# EAGLE design VCF-LM324-Stereo (EAGLE 7.2.0)
Voltage-Controlled Low-Pass Filter using LM324 Quad-Opamp (Stereo) http://electro-music.com/forum/topic-45231-0.html&postdays=0&postorder=asc&highlight=
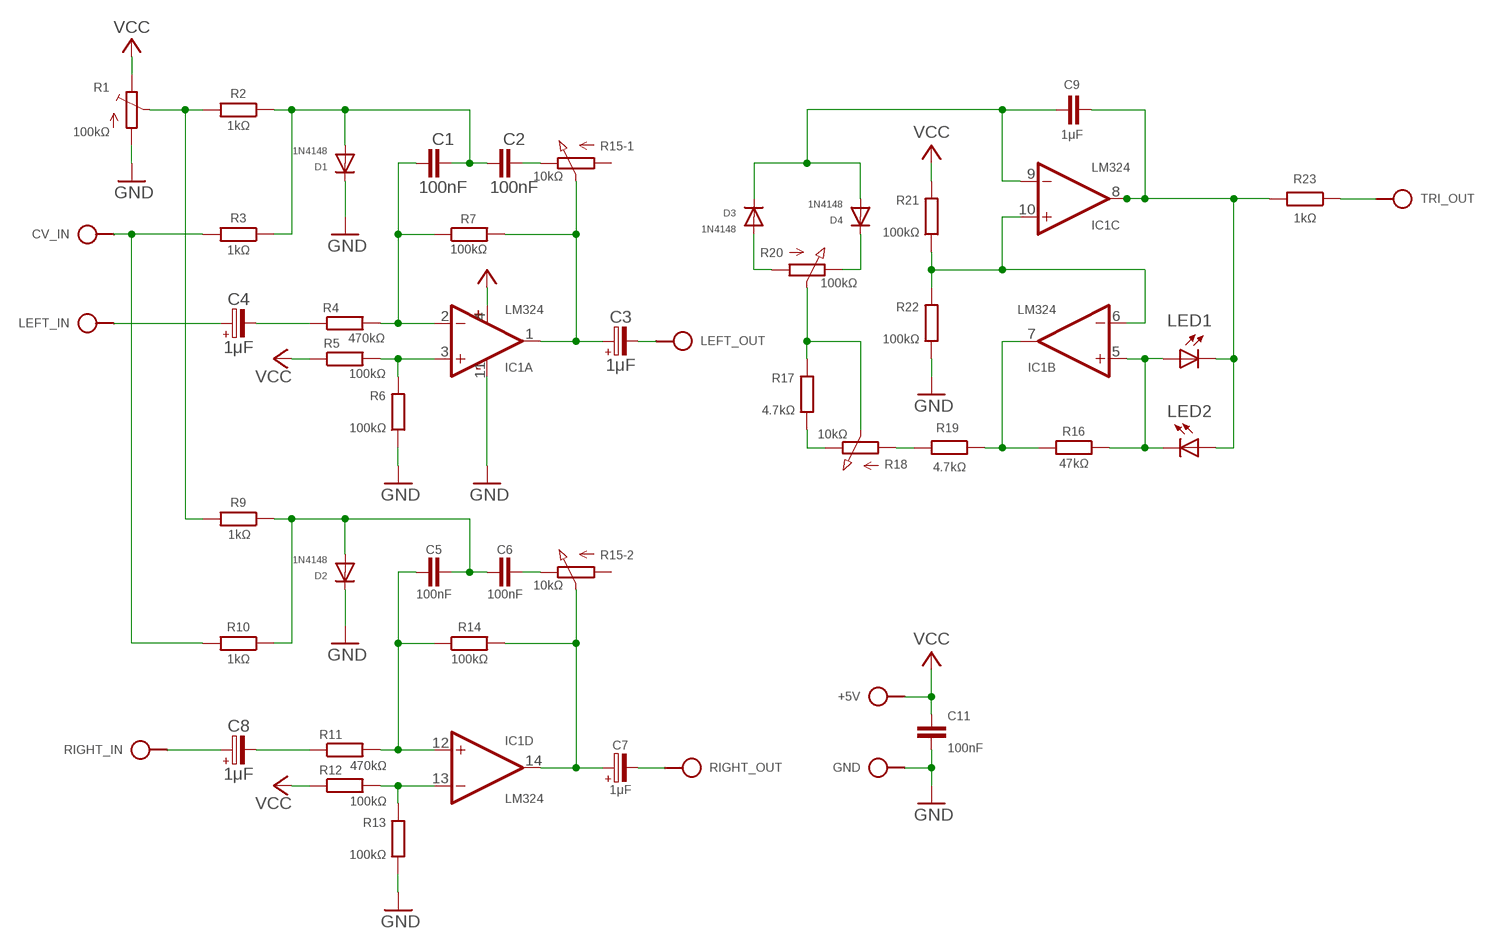
[diagram p0: schematic, sheet 1]

## Parts
+5V  VCC  SPAD  [SPAD]
C1  100nF  C050-024X044  [C050-024X044]
C2  100nF  C050-024X044  [C050-024X044]
C3  1μF  CPOLE2,5-3  [E2,5-3]
C4  1μF  CPOLE2,5-3  [E2,5-3]
C5  100nF  C050-024X044  [C050-024X044]
C6  100nF  C050-024X044  [C050-024X044]
C7  1μF  CPOLE2,5-3  [E2,5-3]
C8  1μF  CPOLE2,5-3  [E2,5-3]
C9  1μF  C050-024X044/V  [C050-024X044/V]
C11  100nF  C050-020X036  [C050-020X036]
CV_IN  CV_IN  SPAD  [SPAD]
D1  1N4148  1N414834-10V  [DO34-10V]
D2  1N4148  1N414834-7V  [DO34-7V]
D3  1N4148  1N414834-7V  [DO34-7V]
D4  1N4148  1N414834-7V  [DO34-7V]
GND  GND  SPAD  [SPAD]
IC1  LM324  LM324N  [DIL14]
LED1  LED3MM  [LED3MM]
LED2  LED3MM  [LED3MM]
LEFT_IN  AUDIO_IN  SPAD  [SPAD]
LEFT_OUT  AUDIO_OUT  SPAD  [SPAD]
R1  100kΩ  TRIM  [B64Y]
R2  1kΩ  R0202/7  [0202/7]
R3  1kΩ  R0202/7  [0202/7]
R4  470kΩ  R0202/7  [0202/7]
R5  100kΩ  R0202/7  [0202/7]
R6  100kΩ  R0202/7  [0202/7]
R7  100kΩ  R0202/7  [0202/7]
R9  1kΩ  R0202/10  [0202/10]
R10  1kΩ  R0202/10  [0202/10]
R11  470kΩ  R0202/7  [0202/7]
R12  100kΩ  R0202/7  [0202/7]
R13  100kΩ  R0202/7  [0202/7]
R14  100kΩ  R0202/7  [0202/7]
R15  10kΩ  POT-STEREO  [POT-STEREO-2X3]
R16  47kΩ  R0202/7-V  [0202/7-V]
R17  4.7kΩ  R0202/7  [0202/7]
R18  10kΩ  POT  [POT]
R19  4.7kΩ  R0202/7-V  [0202/7-V]
R20  100kΩ  POT  [POT]
R21  100kΩ  R0202/7-V  [0202/7-V]
R22  100kΩ  R0202/7-V  [0202/7-V]
R23  1kΩ  R0202/7-V  [0202/7-V]
RIGHT_IN  AUDIO_IN  SPAD  [SPAD]
RIGHT_OUT  AUDIO_OUT  SPAD  [SPAD]
TRI_OUT  TRIANGLE  SPAD  [SPAD]

## Nets
GND: C11.2 D1.C D2.C GND.1 IC1.11(P:V-) R1.A R6.1 R13.1 R22.1
N$1: C4.+ LEFT_IN.1
N$2: C1.1 IC1.2(A:-IN) R4.2 R7.1
N$3: C2.2 R15.1-E(-1:E)
N$4: C3.+ IC1.1(A:OUT) R7.2 R15.1-S(-1:S)
N$5: R1.S R2.2 R9.2
N$6: C3.- LEFT_OUT.1
N$7: IC1.3(A:+IN) R5.2 R6.2
N$8: CV_IN.1 R3.2 R10.2
N$9: C1.2 C2.1 D1.A R2.1 R3.1
N$10: C4.- R4.1
N$11: C6.2 R15.2-E(-2:E)
N$12: C7.+ IC1.14(D:OUT) R14.2 R15.2-S(-2:S)
N$13: IC1.13(D:-IN) R12.2 R13.2
N$14: IC1.7(B:OUT) R16.2 R19.1
N$15: IC1.5(B:+IN) LED1.A LED2.K(C) R16.1
N$16: C5.2 C6.1 D2.A R9.1 R10.1
N$17: C5.1 IC1.12(D:+IN) R11.2 R14.1
N$18: C7.- RIGHT_OUT.1
N$19: C8.+ RIGHT_IN.1
N$20: C8.- R11.1
N$26: C9.1 D3.C D4.A IC1.9(C:-IN)
N$28: C9.2 IC1.8(C:OUT) LED1.K(C) LED2.A R23.2
OA_C_IN+: IC1.6(B:-IN) IC1.10(C:+IN) R21.1 R22.2
TRI_OUT: R23.1 TRI_OUT.1
TRIM_1_A: D3.A R20.1(A)
TRIM_1_B: D4.C R20.3(E)
TRIM_2_A: R17.1 R18.3(E)
TRIM_2_B: R18.1(A) R19.2
TRIM_P: R17.2 R18.2(S) R20.2(S)
VCC: +5V.1 C11.1 IC1.4(P:V+) R1.E R5.1 R12.1 R21.2
Unconnected: R15.1-A(-1:A) R15.2-A(-2:A)

## Library data of the parts
+5V CV_IN GND LEFT_IN LEFT_OUT RIGHT_IN RIGHT_OUT TRI_OUT = pad:SPAD
C1 C2 C5 C6 C9 C11 = c:C: CAPACITOR, European symbol
C3 C4 C7 C8 = c:CPOL: POLARIZED CAPACITOR, European symbol
D1-D4 = d:1N4148
IC1 = ic:LM324: OP AMP
LED1 LED2 = led:LED: LED OSRAM: - CHIPLED LG R971, LG N971, LY N971, LG Q971, LY Q971, LO R971, LY R971 LH N974, LH R974 LS Q976, LO Q976, LY Q976 LO Q996 - Hyper CHIPLED LW Q18S LB Q993, LB Q99A, LB R99A - SideLED LS A670, LO A670, LY A670, LG A670, LP A670 LB A673, LV A673, LT A673, LW A673 LH A674 LY A675 LS A676, LA A676, LO A676, LY A676, LW A676 LS A679, LY A679, LG A679 - Hyper Micro SIDELED@@ LS Y876, LA Y876, LO Y876, LY Y876 LT Y87S - SmartLED LW L88C, LW L88S LB L89C, LB L89S, LG L890 LS L89K, LO L89K, LY L89K LS L896, LA L896, LO L896, LY L896 - TOPLED LS T670, LO T670, LY T670, LG T670, LP T670 LSG T670, LSP T670, LSY T670, LOP T670, LYG T670 LG T671, LOG T671, LSG T671 LB T673, LV T673, LT T673, LW T673 LH T674 LS T676, LA T676, LO T676, LY T676, LB T676, LH T676, LSB T676, LW T676 LB T67C, LV T67C, LT T67C, LS T67K, LO T67K, LY T67K, LW E67C LS E67B, LA E67B, LO E67B, LY E67B, LB E67C, LV E67C, LT E67C LW T67C LS T679, LY T679, LG T679 LS T770, LO T770, LY T770, LG T770, LP T770 LB T773, LV T773, LT T773, LW T773 LH T774 LS E675, LA E675, LY E675, LS T675 LS T776, LA T776, LO T776, LY T776, LB T776 LHGB T686 LT T68C, LB T68C - Hyper Mini TOPLED@@ LB M676 - Mini TOPLED Santana@@ LG M470 LS M47K, LO M47K, LY M47K Source: http://www.osram.convergy.de LUXEON: - LUMILED@@ LXK2-PW12-R00, LXK2-PW12-S00, LXK2-PW14-U00, LXK2-PW14-V00 LXK2-PM12-R00, LXK2-PM12-S00, LXK2-PM14-U00 LXK2-PE12-Q00, LXK2-PE12-R00, LXK2-PE12-S00, LXK2-PE14-T00, LXK2-PE14-U00 LXK2-PB12-K00, LXK2-PB12-L00, LXK2-PB12-M00, LXK2-PB14-N00, LXK2-PB14-P00, LXK2-PB14-Q00 LXK2-PR12-L00, LXK2-PR12-M00, LXK2-PR14-Q00, LXK2-PR14-R00 LXK2-PD12-Q00, LXK2-PD12-R00, LXK2-PD12-S00 LXK2-PH12-R00, LXK2-PH12-S00 LXK2-PL12-P00, LXK2-PL12-Q00, LXK2-PL12-R00 Source: www.luxeon.com KINGBRIGHT: KA-3528ASYC Source: www.kingbright.com
R1 = r:TRIM: POTENTIOMETER
R2-R7 R9-R14 R16 R17 R19 R21-R23 = r:R: RESISTOR, European symbol
R15 = r:POT-STEREO
R18 R20 = r:POT

## Board
Voltage-Controlled Low-Pass Filter using LM324 Quad-Opamp (Stereo) http://electro-music.com/forum/topic-45231-0.html&postdays=0&postorder=asc&highlight=
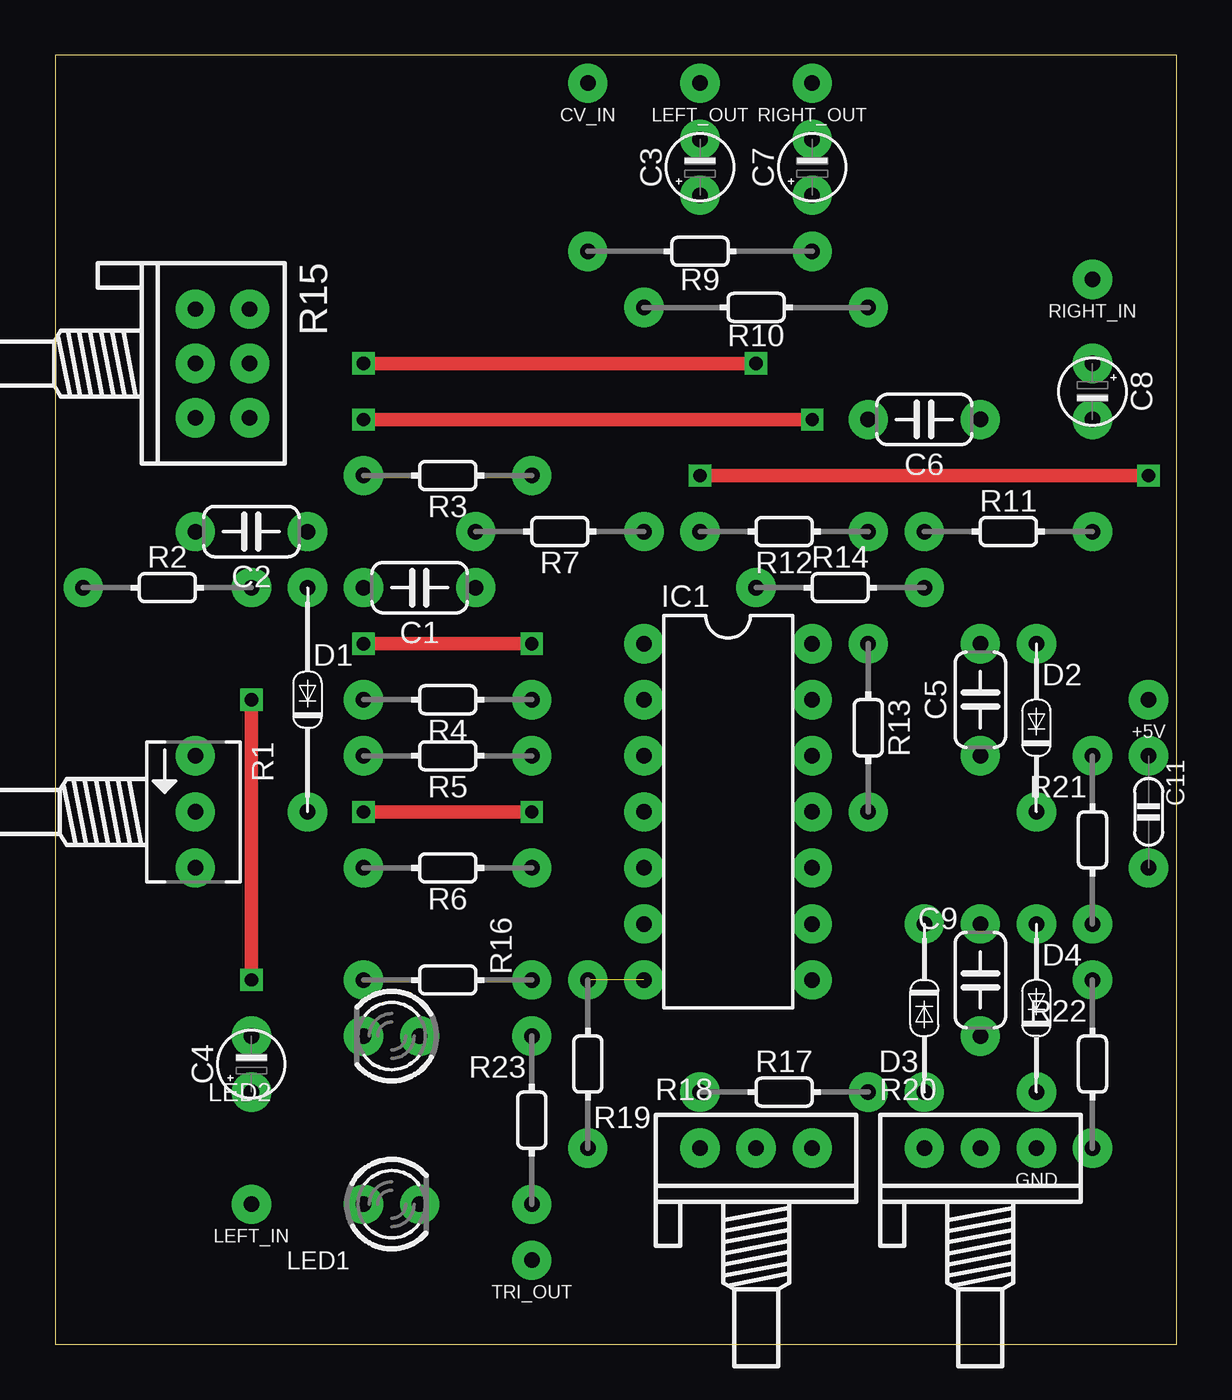
[diagram p1: board, top side]
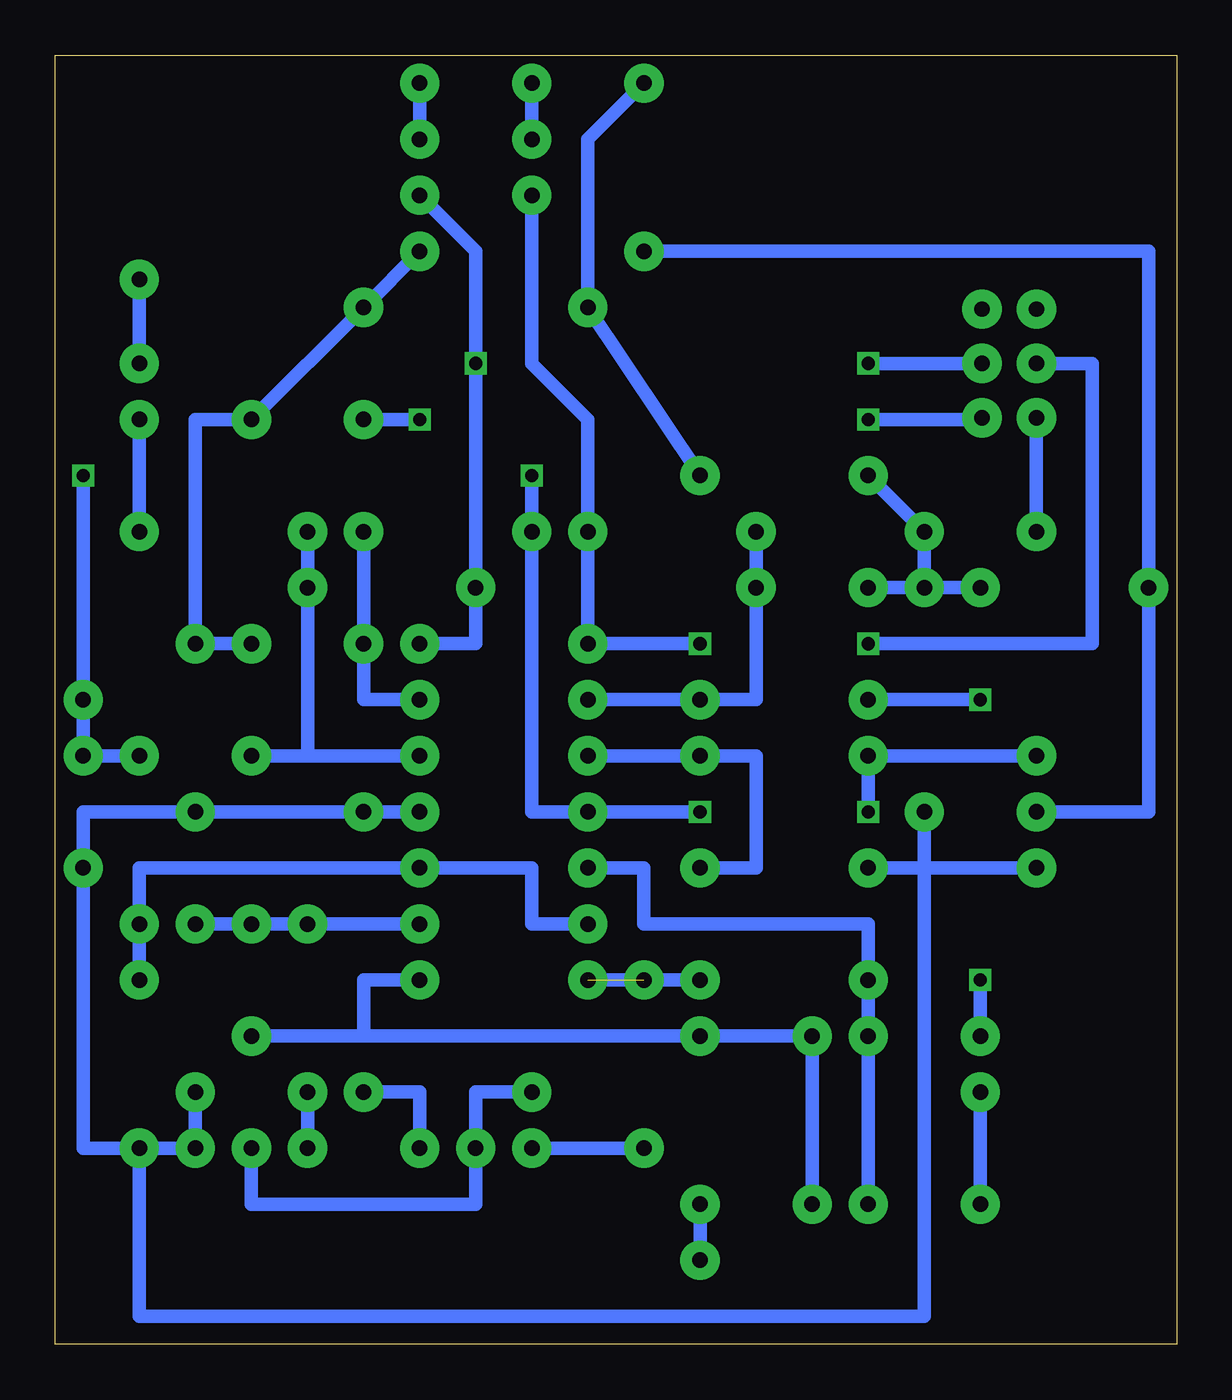
[diagram p2: board, bottom side, seen from below]

Size 50.8 x 58.42 mm. Coordinates in mm from the lower left corner, seen from the top.
Outline: 0,0 50.8,0 50.8,58.42 0,58.42 0,0
Copper layers (1*16): Top 0.035mm / dielectric 1.5mm / Bottom 0.035mm
Design rules "default": minimum track width 10mil, minimum drill 24mil, track to track 8mil, track to pad 8mil, pad to pad 8mil, via to via 8mil, smd to smd 8mil, copper to edge 40mil, drill to drill 8mil, minimum pad ring 10mil, minimum via ring 8mil, stop-mask expansion 4mil, vias tented up to drill 0mil, thermal gap 10mil

### Footprints (pad centres in the part's own frame; a part is rotated, then mirrored left to right if it is on the bottom)
SPAD = drill 0.7 pad 1.778: 1 0,0
C050-024X044 = drill 0.7 pad 1.778: 1 -2.54,0; 2 2.54,0
E2,5-3 = drill 0.7 pad 1.778: + 0,1.27; - 0,-1.27
C050-024X044/V = drill 0.7 pad 1.778: 1 0,2.54; 2 0,-2.54
C050-020X036 = drill 0.7 pad 1.778: 1 -2.54,0; 2 2.54,0
DO34-10V = drill 0.7 pad 1.778: A 0,5.08; C 0,-5.08
DO34-7V = drill 0.7 pad 1.778: A 0,3.81; C 0,-3.81
DIL14 = drill 0.7 pad 1.778: 1 -3.81,7.62; 2 -3.81,5.08; 3 -3.81,2.54; 4 -3.81,0; 5 -3.81,-2.54; 6 -3.81,-5.08; 7 -3.81,-7.62; 8 3.81,-7.62; 9 3.81,-5.08; 10 3.81,-2.54; 11 3.81,0; 12 3.81,2.54; 13 3.81,5.08; 14 3.81,7.62
LED3MM = drill 0.7 pad 1.778: A -1.27,0; K 1.27,0
B64Y = drill 0.7 pad 1.778: A 2.54,0; E -2.54,0; S 0,0
0202/7 = drill 0.7 pad 1.778: 1 0,3.81; 2 0,-3.81
0202/10 = drill 0.7 pad 1.778: 1 -5.08,0; 2 5.08,0
POT-STEREO-2X3 = drill 0.7 pad 1.778: 1-A -2.46,-2.54; 1-E 2.46,-2.54; 1-S 0,-2.54; 2-A -2.46,-0.08; 2-E 2.46,-0.08; 2-S 0,-0.08
0202/7-V = drill 0.7 pad 1.778: 1 0,-3.81; 2 0,3.81
POT = drill 0.7 pad 1.778: 1 -2.54,0; 2 0,0; 3 2.54,0

### Placement (x,y rotation side)
+5V  49.53,29.21 90 top
C1  16.51,34.29 180 top
C2  8.89,36.83 180 top
C3  29.21,53.34 180 top
C4  8.89,12.7 180 top
C5  41.91,29.21 90 top
C6  39.37,41.91 180 top
C7  34.29,53.34 180 top
C8  46.99,43.18 0 top
C9  41.91,16.51 0 top
C11  49.53,24.13 270 top
CV_IN  24.13,57.15 90 top
D1  11.43,29.21 0 top
D2  44.45,27.94 0 top
D3  39.37,15.24 180 top
D4  44.45,15.24 0 top
GND  44.45,8.89 90 top
IC1  30.48,24.13 0 top
LED1  15.24,6.35 0 top
LED2  15.24,13.97 180 top
LEFT_IN  8.89,6.35 90 top
LEFT_OUT  29.21,57.15 90 top
R1  6.35,24.13 270 top
R2  5.08,34.29 270 top
R3  17.78,39.37 90 top
R4  17.78,29.21 90 top
R5  17.78,26.67 90 top
R6  17.78,21.59 90 top
R7  22.86,36.83 90 top
R9  29.21,49.53 180 top
R10  31.75,46.99 180 top
R11  43.18,36.83 270 top
R12  33.02,36.83 90 top
R13  36.83,27.94 180 top
R14  35.56,34.29 270 top
R15  8.89,44.45 270 top
R16  17.78,16.51 270 top
R17  33.02,11.43 270 top
R18  31.75,8.89 0 top
R19  24.13,12.7 180 top
R20  41.91,8.89 0 top
R21  46.99,22.86 0 top
R22  46.99,12.7 0 top
R23  21.59,10.16 0 top
RIGHT_IN  46.99,48.26 90 top
RIGHT_OUT  34.29,57.15 90 top
TRI_OUT  21.59,3.81 90 top

### Tracks (layer width: path | path; a pad name or v marks a point on that pad's centre or on a via)
GND
  Bottom 0.61: IC1.11 R13.1 D2.C 49.53,24.13 C11.2 49.53,8.89 R22.1 | D1.C 11.43,21.59 | 12.7,21.59 R6.1 | R1.A R6.1 | R6.1 11.43,21.59 | 11.43,21.59 11.43,1.27 46.99,1.27 R22.1 | R22.1 GND.1
N$1
  Bottom 0.61: C4.+ LEFT_IN.1
N$2
  Bottom 0.61: IC1.2 R4.2 19.05,29.21 C1.1 R7.1
N$3
  Bottom 0.61: C2.2 6.35,41.91
N$4  (via drill 0.6)
  Top 0.61: v13.97,31.75 v21.59,31.75
  Bottom 0.61: C3.+ 29.21,44.45 26.67,41.91 R7.2 IC1.1 v21.59,31.75 | R15.1-S 3.81,44.45 3.81,31.75 v13.97,31.75
N$5
  Bottom 0.61: R1.S 1.27,24.13 R2.2 1.27,49.53 R9.2
N$6
  Bottom 0.61: C3.- LEFT_OUT.1
N$7
  Bottom 0.61: IC1.3 R5.2 19.05,26.67 19.05,21.59 R6.2
N$8  (via drill 0.6)
  Bottom 0.61: R3.2 R10.2 26.67,54.61 CV_IN.1
  other vias: 26.67,46.99 26.67,46.99 26.67,46.99
N$9
  Bottom 0.61: C1.2 D1.A | D1.A C2.1 R3.1 | D1.A R2.1
N$10  (via drill 0.6)
  Top 0.61: v8.89,16.51 v8.89,29.21
  Bottom 0.61: C4.- v8.89,16.51 | v8.89,29.21 R4.1
N$11  (via drill 0.6)
  Top 0.61: v34.29,41.91 v13.97,41.91
  Bottom 0.61: C6.2 v34.29,41.91 | v13.97,41.91 11.43,41.91 8.89,41.91
N$12  (via drill 0.6)
  Top 0.61: v31.75,44.45 v13.97,44.45
  Bottom 0.61: IC1.14 31.75,31.75 R14.2 v31.75,44.45 31.75,49.53 C7.+ | v13.97,44.45 8.89,44.45
N$13
  Bottom 0.61: IC1.13 36.83,29.21 R13.2 R12.2
N$14  (1 unrouted)
  Bottom 0.61: IC1.7 R16.2
N$15
  Bottom 0.61: LED1.A LED2.K R16.1 13.97,19.05 24.13,19.05 24.13,21.59 IC1.5
N$16
  Bottom 0.61: R9.1 R10.1 C6.1 44.45,41.91 D2.A C5.2
N$17
  Bottom 0.61: R11.2 R14.1 39.37,26.67 | C5.1 39.37,26.67 | 39.37,26.67 IC1.12
N$18
  Bottom 0.61: C7.- RIGHT_OUT.1
N$19
  Bottom 0.61: C8.+ RIGHT_IN.1
N$20
  Bottom 0.61: C8.- R11.1
N$26
  Bottom 0.61: C9.1 D4.A D3.C IC1.9
N$28
  Bottom 0.61: 36.83,13.97 R23.2 LED2.A LED1.K | C9.2 36.83,13.97 | 36.83,13.97 36.83,16.51 IC1.8
OA_C_IN+
  Bottom 0.61: R22.2 R21.1 46.99,21.59 IC1.10 29.21,21.59 29.21,19.05 IC1.6
TRI_OUT
  Bottom 0.61: TRI_OUT.1 R23.1
TRIM_1_A
  Bottom 0.61: D3.A R20.1
TRIM_1_B
  Bottom 0.61: D4.C R20.3
TRIM_2_A
  Bottom 0.61: R17.1 34.29,11.43 R18.3
TRIM_2_B
  Bottom 0.61: R18.1 R19.2
TRIM_P
  Bottom 0.61: R17.2 31.75,11.43 R18.2 31.75,6.35 41.91,6.35 R20.2
VCC  (via drill 0.6)
  Top 0.61: v21.59,24.13 v13.97,24.13 | v49.53,39.37 v29.21,39.37
  Bottom 0.61: 27.94,24.13 IC1.4 | IC1.4 29.21,24.13 R12.1 v29.21,39.37 | IC1.4 v21.59,24.13 | v13.97,24.13 R5.1 R1.E | R21.2 C11.1 +5V.1 v49.53,39.37